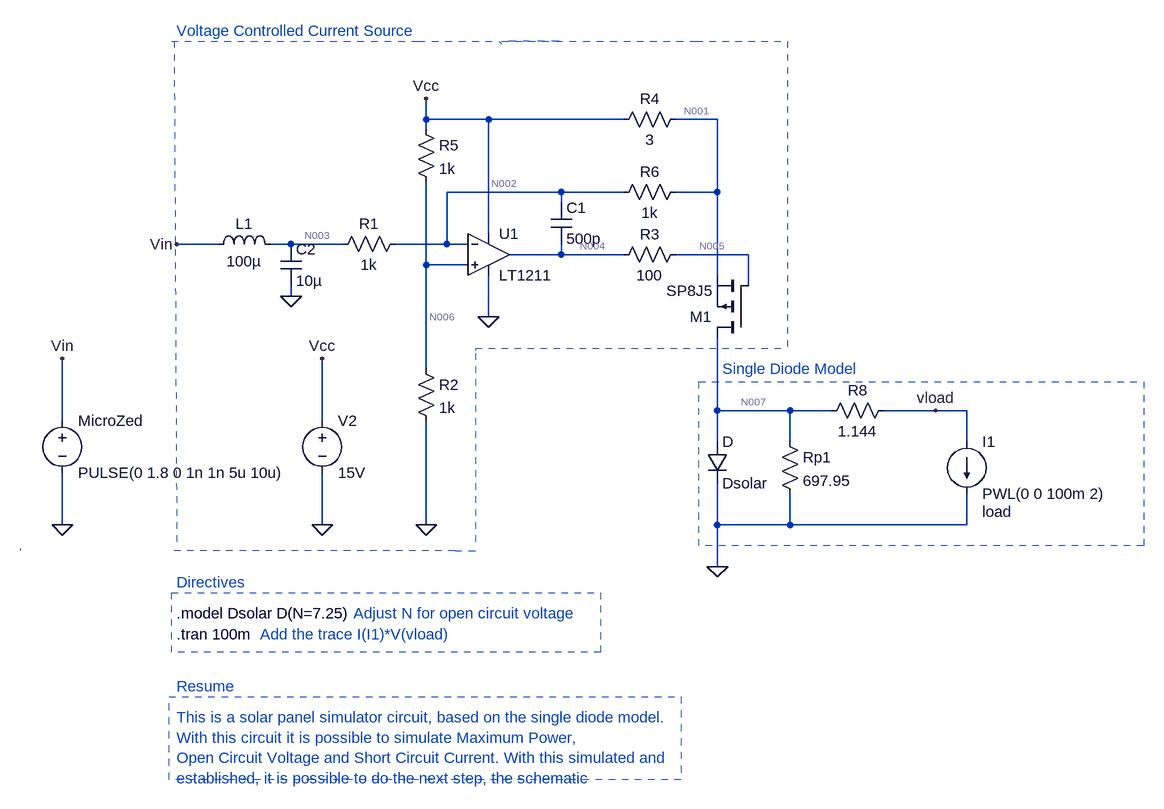
[diagram p0: schematic current-source-panels-max-power.asc]
current-source-panels-max-power.asc, the LTspice schematic file:
Version 4
SHEET 1 2736 2348
WIRE 272 96 272 64
WIRE 368 96 272 96
WIRE 576 96 368 96
WIRE 720 96 656 96
WIRE 272 112 272 96
WIRE 480 208 304 208
WIRE 576 208 480 208
WIRE 720 208 720 96
WIRE 720 208 656 208
WIRE 480 224 480 208
WIRE 368 272 368 96
WIRE -48 288 -112 288
WIRE 64 288 32 288
WIRE 144 288 64 288
WIRE 304 288 304 208
WIRE 304 288 224 288
WIRE 336 288 304 288
WIRE 480 304 480 288
WIRE 480 304 400 304
WIRE 576 304 480 304
WIRE 768 304 656 304
WIRE 272 320 272 192
WIRE 336 320 272 320
WIRE 720 336 720 208
WIRE 768 352 768 304
WIRE 64 368 64 352
WIRE 368 400 368 336
WIRE 272 480 272 320
WIRE 720 544 720 432
WIRE 832 544 720 544
WIRE 896 544 832 544
WIRE 1056 544 976 544
WIRE 1104 544 1056 544
WIRE -288 560 -288 464
WIRE 112 560 112 464
WIRE 720 592 720 544
WIRE 832 592 832 544
WIRE 1104 592 1104 544
WIRE -288 720 -288 640
WIRE 112 720 112 640
WIRE 272 720 272 560
WIRE 720 720 720 656
WIRE 832 720 832 672
WIRE 832 720 720 720
WIRE 1104 720 1104 672
WIRE 1104 720 832 720
WIRE 720 784 720 720
FLAG -288 720 0
FLAG 112 720 0
FLAG -288 464 Vin
FLAG 112 464 Vcc
FLAG 272 64 Vcc
FLAG 368 400 0
FLAG 1056 544 vload
FLAG 720 784 0
FLAG 272 720 0
FLAG -112 288 Vin
FLAG 64 368 0
SYMBOL OpAmps/LT1211 368 240 R0
SYMATTR InstName U1
SYMBOL Res 240 272 R90
WINDOW 0 0 56 VBottom 2
WINDOW 3 32 56 VTop 2
SYMATTR InstName R1
SYMATTR Value 1k
SYMBOL Res 256 464 R0
SYMATTR InstName R2
SYMATTR Value 1k
SYMBOL Res 672 288 R90
WINDOW 0 0 56 VBottom 2
WINDOW 3 32 56 VTop 2
SYMATTR InstName R3
SYMATTR Value 100
SYMBOL pmos 768 432 R180
SYMATTR InstName M1
SYMATTR Value SP8J5
SYMBOL Res 672 80 R90
WINDOW 0 0 56 VBottom 2
WINDOW 3 32 56 VTop 2
SYMATTR InstName R4
SYMATTR Value 3
SYMBOL Res 256 96 R0
SYMATTR InstName R5
SYMATTR Value 1k
SYMBOL Res 672 192 R90
WINDOW 0 0 56 VBottom 2
WINDOW 3 32 56 VTop 2
SYMATTR InstName R6
SYMATTR Value 1k
SYMBOL Cap 464 224 R0
SYMATTR InstName C1
SYMATTR Value 500p
SYMBOL voltage -288 544 R0
SYMATTR InstName MicroZed
SYMATTR Value PULSE(0 1.8 0 1n 1n 5u 10u)
SYMBOL voltage 112 544 R0
SYMATTR InstName V2
SYMATTR Value 15V
SYMBOL diode 704 592 R0
SYMATTR InstName D
SYMATTR Value Dsolar
SYMBOL res 816 576 R0
SYMATTR InstName Rp1
SYMATTR Value 697.95
SYMBOL res 992 528 R90
WINDOW 0 0 56 VBottom 2
WINDOW 3 32 56 VTop 2
SYMATTR InstName R8
SYMATTR Value 1.144
SYMBOL current 1104 592 R0
WINDOW 123 0 0 Left 0
WINDOW 39 24 108 Left 2
SYMATTR SpiceLine load
SYMATTR InstName I1
SYMATTR Value PWL(0 0 100m 2)
SYMBOL ind -64 304 R270
WINDOW 0 32 56 VTop 2
WINDOW 3 5 56 VBottom 2
SYMATTR InstName L1
SYMATTR Value 100µ
SYMBOL Cap 48 288 R0
SYMATTR InstName C2
SYMATTR Value 10µ
TEXT -112 856 Left 2 !.model Dsolar D(N=7.25)
TEXT 160 856 Left 2 ;Adjust N for open circuit voltage
TEXT -112 888 Left 2 !.tran 100m
TEXT -112 1016 Left 2 ;This is a solar panel simulator circuit, based on the single diode model.\nWith this circuit it is possible to simulate Maximum Power,\nOpen Circuit Voltage and Short Circuit Current. With this simulated and\nestablished, it is possible to do the next step, the schematic
TEXT -112 -40 Left 2 ;Voltage Controlled Current Source
TEXT -112 968 Left 2 ;Resume
TEXT -112 808 Left 2 ;Directives
TEXT 728 480 Left 2 ;Single Diode Model
TEXT 16 888 Left 2 ;Add the trace I(I1)*V(vload)
LINE Normal 316 760 -116 760 3
LINE Normal 348 456 348 756 3
LINE Normal -120 -24 124 -24 3
LINE Normal 124 -24 260 -24 3
LINE Normal 260 -24 384 -24 3
LINE Normal 384 -24 388 -20 2
LINE Normal 476 -24 388 -24 2
LINE Normal 388 -24 576 -24 3
LINE Normal 576 -24 688 -24 2
LINE Normal 688 -24 828 -24 2
LINE Normal 828 -24 828 456 3
LINE Normal 348 448 348 452 3
LINE Normal 348 448 828 448 3
LINE Normal -352 760 -352 756 3
LINE Normal -116 -24 -112 756 3
LINE Normal 316 760 348 760 3
RECTANGLE Normal -124 984 664 1112 2
RECTANGLE Normal -120 824 540 916 3
RECTANGLE Normal 692 500 1376 752 3

The netlist it stands for:
* current-source-panels-max-power.asc
XU1 N006 N002 Vcc 0 N004 LT1211  ; pins In+ In- V+ V- OUT
R1 N002 N003 1k
R2 N006 0 1k
R3 N005 N004 100
M1 N007 N005 N001 N001 SP8J5
R4 N001 Vcc 3
R5 Vcc N006 1k
R6 N001 N002 1k
C1 N002 N004 500p
V§MicroZed Vin 0 PULSE(0 1.8 0 1n 1n 5u 10u)
V2 Vcc 0 15V
D N007 0 Dsolar
Rp1 N007 0 697.95
R8 vload N007 1.144
I1 vload 0 PWL(0 0 100m 2) load
L1 Vin N003 100µ
C2 N003 0 10µ
.model D D
.lib standard.dio
.model NMOS NMOS
.model PMOS PMOS
.lib standard.mos
.model Dsolar D(N=7.25)
* Adjust N for open circuit voltage
.tran 100m
* This is a solar panel simulator circuit, based on the single diode model.
* With this circuit it is possible to simulate Maximum Power,
* Open Circuit Voltage and Short Circuit Current. With this simulated and
* established, it is possible to do the next step, the schematic
* Voltage Controlled Current Source
* Resume
* Directives
* Single Diode Model
* Add the trace I(I1)*V(vload)
.lib LTC.lib
.backanno
.end

* Results of the author's LTspice run, read from the files saved beside the schematic
* Operating Point, zero values left out:
*   V(n002) = 7.489 V
*   V(n006) = 7.5 V
*   V(vcc) = 15 V
*   V(n004) = 14.41 V
*   V(n003) = 7.489 µV
*   V(n005) = 14.41 V
*   V(n007) = 20.91 nV
*   V(n001) = 14.98 V
*   V(vload) = 20.91 nV
*   Id(M1) = -14.98 pA
*   Is(M1) = 14.98 pA
*   I(L1) = -7.489 mA
*   I(R1) = 7.489 mA
*   I(R2) = 7.5 mA
*   I(R4) = -7.489 mA
*   I(R5) = 7.5 mA
*   I(R6) = 7.489 mA
*   I(Rp1) = 29.96 pA
*   I(Microzed) = 7.489 mA
*   I(V2) = -16.39 mA
*   Ix(u1:1) = -49.73 nA
*   Ix(u1:2) = -50.29 nA
*   Ix(u1:3) = 1.402 mA
*   Ix(u1:4) = -1.403 mA
*   Ix(u1:5) = -13.82 pA